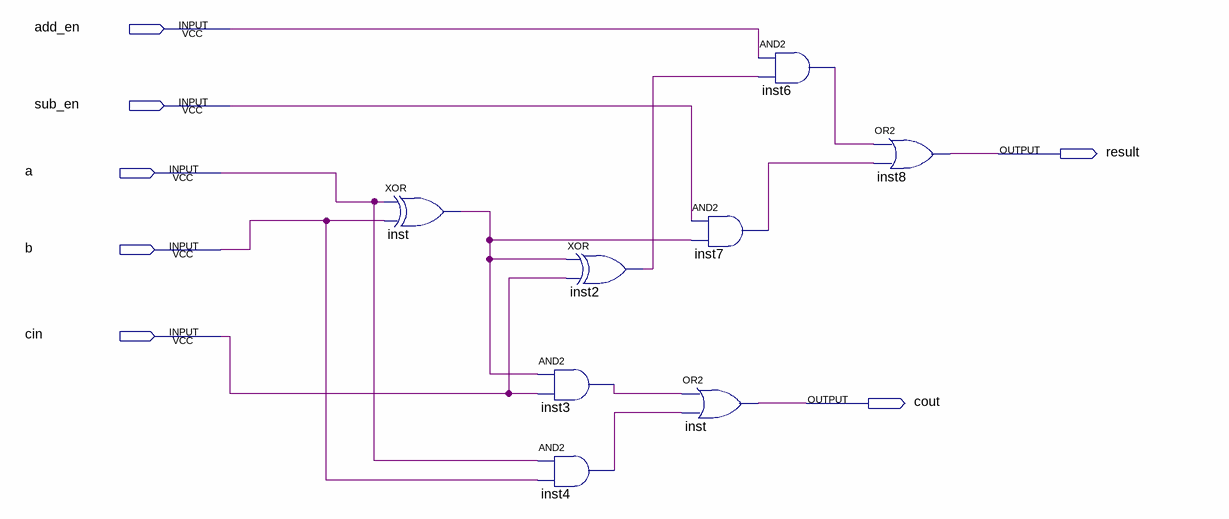
[diagram p0: schematic sheet]
// Quartus schematic lab_4_block_diagram.bdf as structural Verilog: 8 symbols, 7 pins
module lab_4_block_diagram (
  input  add_en,
  input  sub_en,
  input  a,
  input  b,
  input  cin,
  output result,
  output cout
);

  wire inst2_out, inst3_out, inst4_out, inst6_out, inst7_out, inst_out;

  xor inst (inst_out, a, b);
  xor inst2 (inst2_out, inst_out, cin);
  and inst3 (inst3_out, inst_out, cin);
  and inst4 (inst4_out, a, b);
  and inst7 (inst7_out, sub_en, inst_out);
  or inst_dup2 (cout, inst3_out, inst4_out);
  and inst6 (inst6_out, add_en, inst2_out);
  or inst8 (result, inst6_out, inst7_out);
endmodule
